# EAGLE schematic Snach Basics 01 (EAGLE 7.3.0)
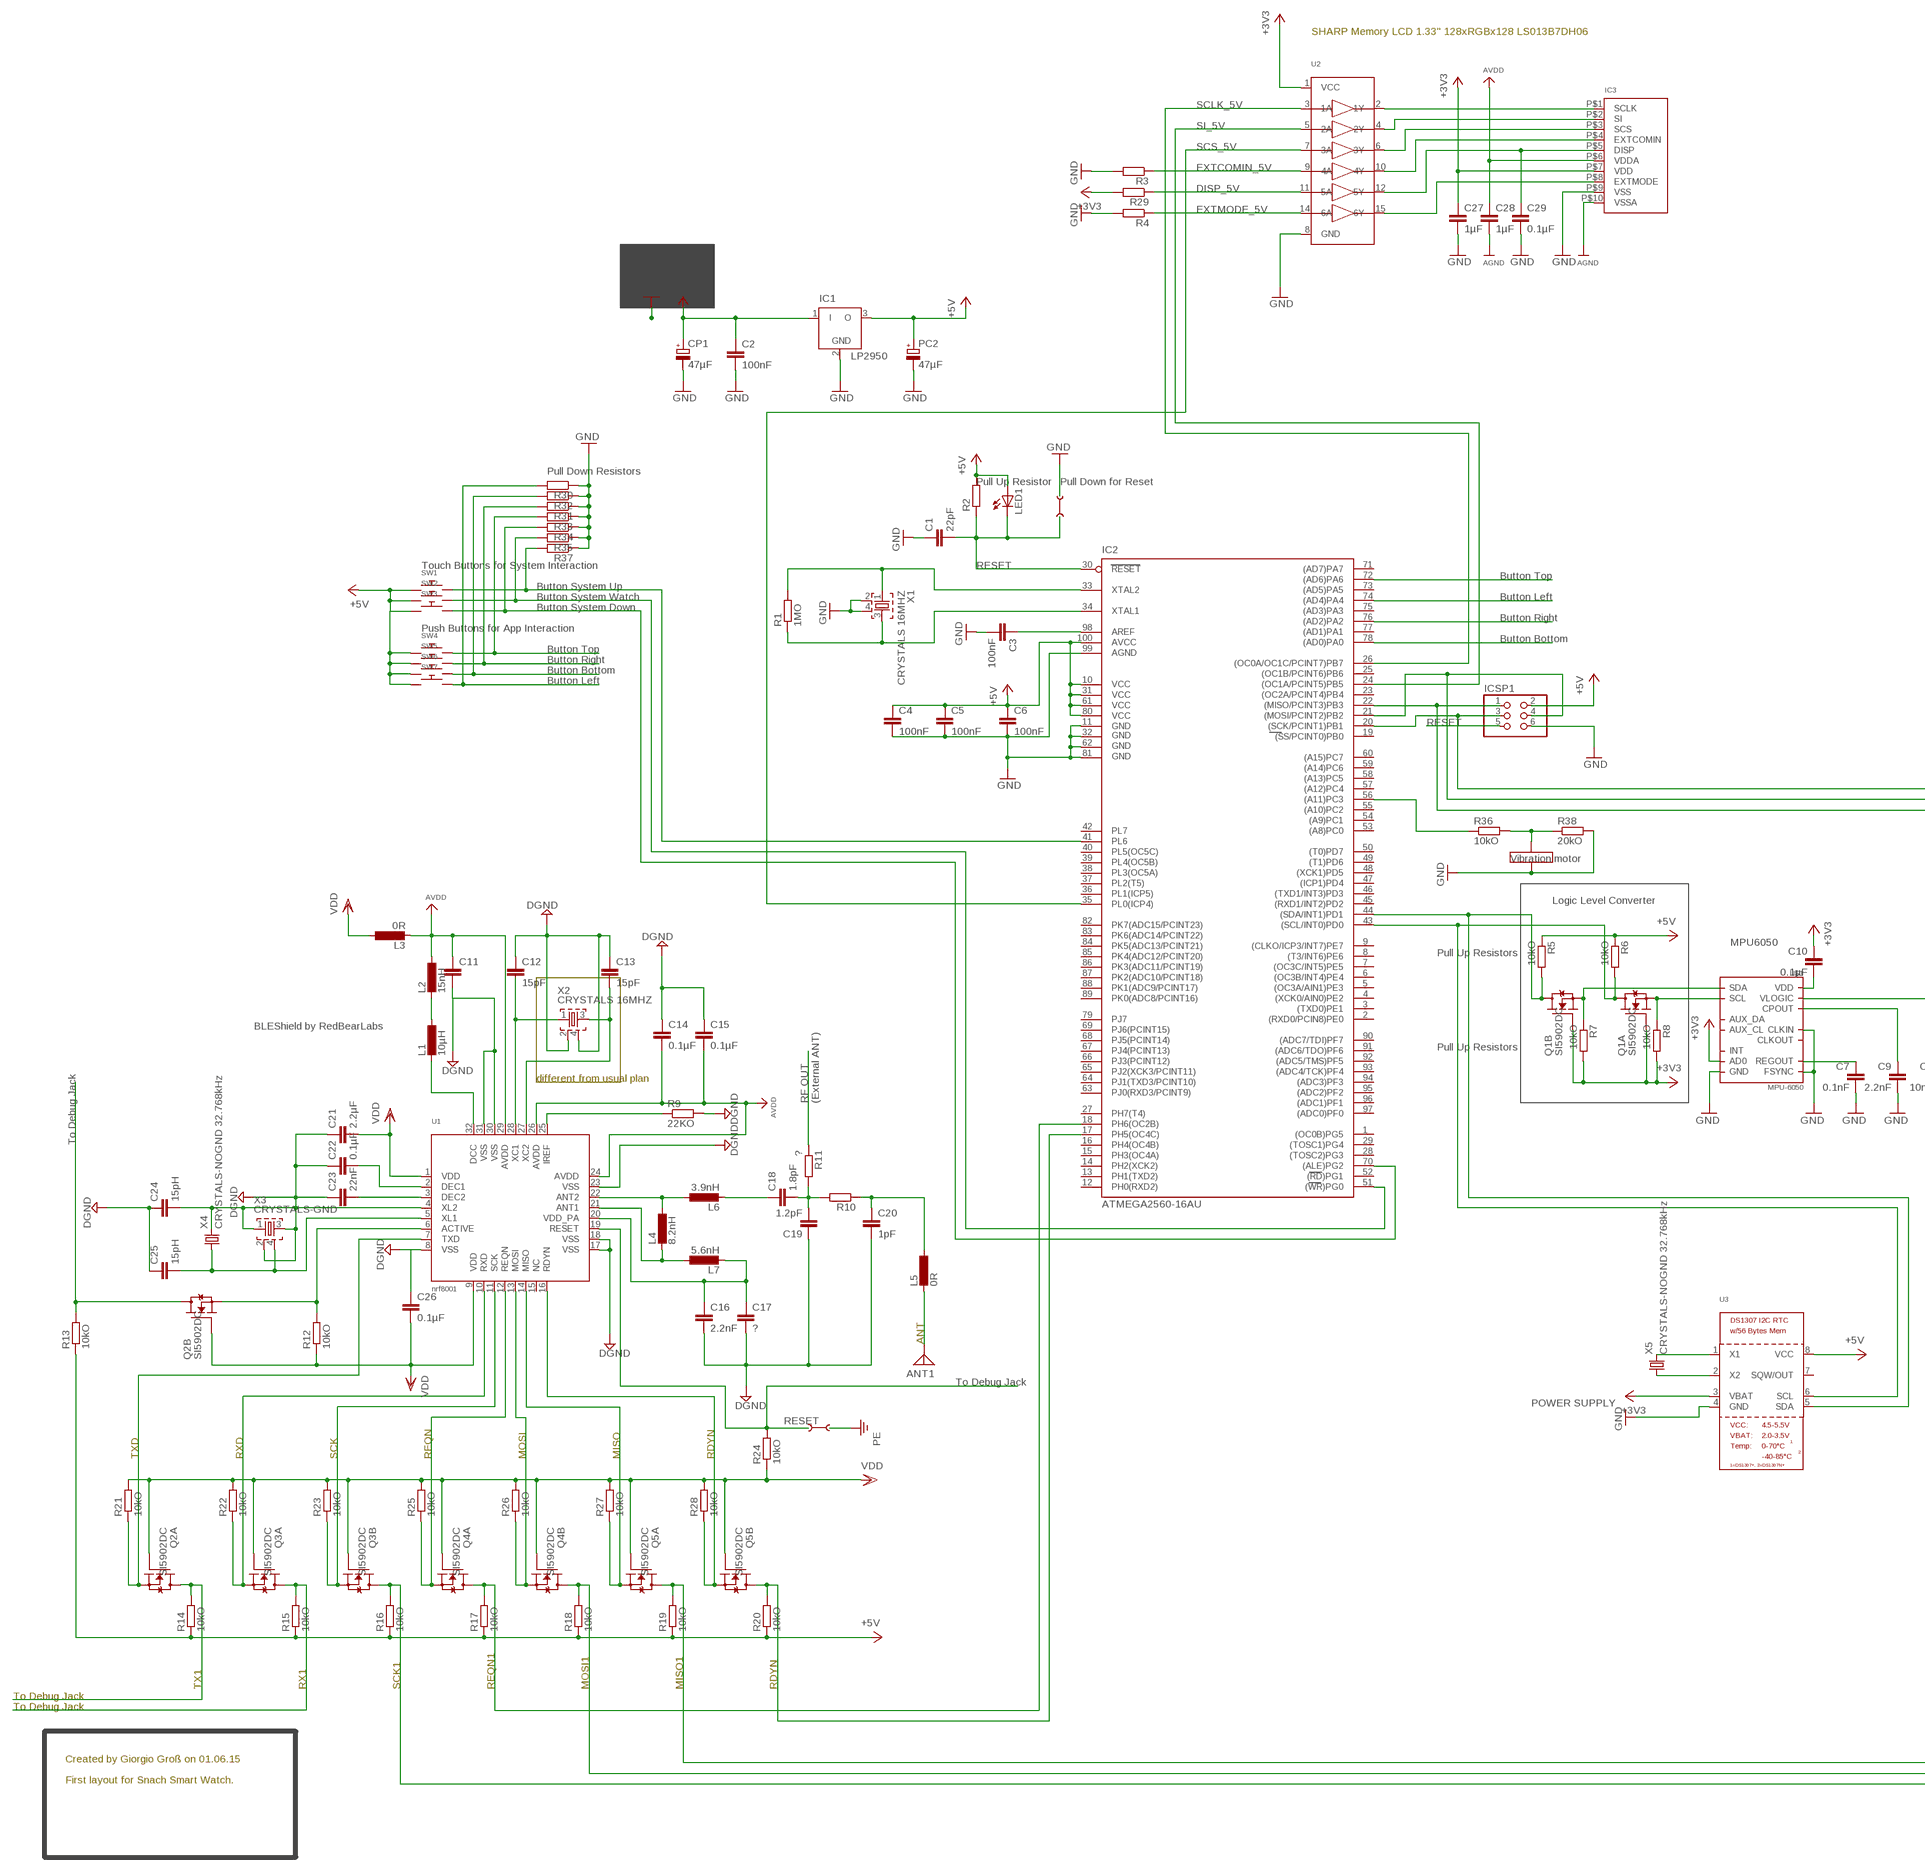
[diagram p0: schematic, sheet 1, part 1 of 2]
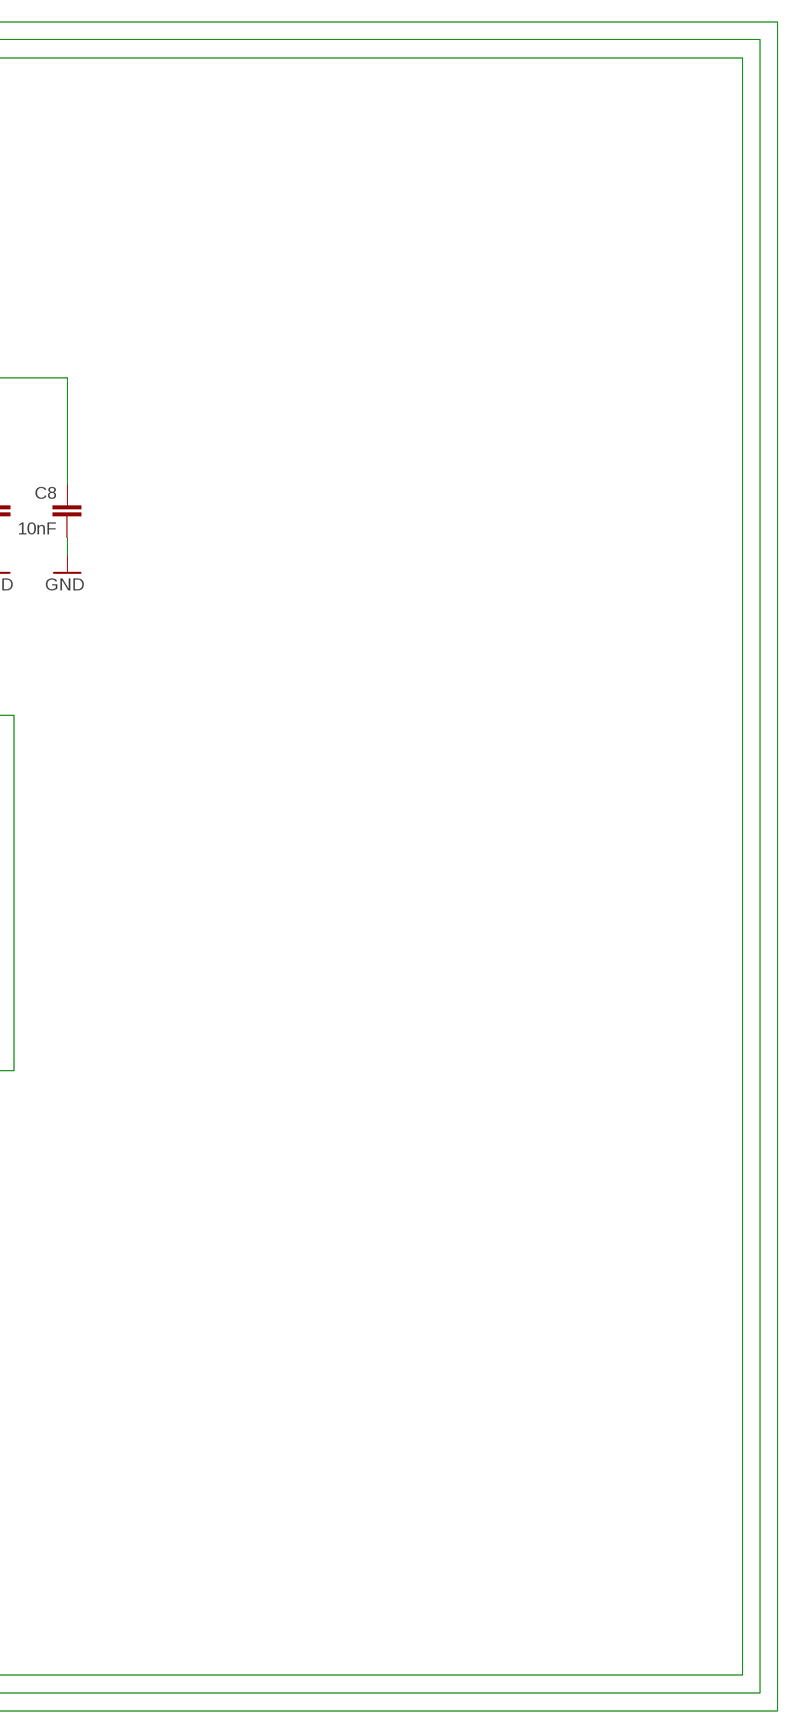
[diagram p1: schematic, sheet 1, part 2 of 2]

## Parts
ANT1  ANTENNA  [PAD-01]
C1  22pF  C-EUC1812  [C1812]
C2  100nF  C-EUC0402  [C0402]
C3  100nF  C-EUC1206K  [C1206K]
C4  100nF  C-EUC1812K  [C1812K]
C5  100nF  C-EUC1812K  [C1812K]
C6  100nF  C-EUC1812K  [C1812K]
C7  0.1nF  C-EUC0402  [C0402]
C8  10nF  C-EUC0402  [C0402]
C9  2.2nF  C-EUC0402  [C0402]
C10  0.1µF  C-EUC0402  [C0402]
C11  C-EUC0504  [C0504]
C12  15pF  C-EUC0603  [C0603]
C13  15pF  C-EUC0603  [C0603]
C14  0.1µF  C-EUC0402K  [C0402K]
C15  0.1µF  C-EUC0402K  [C0402K]
C16  2.2nF  C-EUC0402  [C0402]
C17  ?  C-EUC0402  [C0402]
C18  1.8pF  C-EUC0402  [C0402]
C19  1.2pF  C-EUC0402  [C0402]
C20  1pF  C-EUC0402  [C0402]
C21  2.2µF  C-EUC0402  [C0402]
C22  0.1µF  C-EUC0402  [C0402]
C23  22nF  C-EUC0402  [C0402]
C24  15pH  C-EUC0504  [C0504]
C25  15pH  C-EUC0504  [C0504]
C26  0.1µF  C-EUC0402  [C0402]
C27  1µF  C-EUC0504  [C0504]
C28  1µF  C-EUC0504  [C0504]
C29  0.1µF  C-EUC0504  [C0504]
CP1  47µF  CPOL-EU085CS-1R  [085CS_1R]
IC1  LP2950  [DPACK]
IC2  ATMEGA2560-16AU  [TQFP100]
IC3  DISP_EINK_SHARPMEMORYLCD_10PIN  [FPC_10PIN_52892-1095]
ICSP1  PINHD-2X3  [2X03]
J1  JUMP-Q  [JUMP]
J2  JUMP-Q  [JUMP]
L1  10µH  L-EUL1812  [L1812]
L2  15nH  L-EUL1812  [L1812]
L3  0R  L-EUL1812  [L1812]
L4  8.2nH  L-EUL3216C  [L3216C]
L5  0R  L-EUL2012C  [L2012C]
L6  3.9nH  L-EUL3216C  [L3216C]
L7  5.6nH  L-EUL3216C  [L3216C]
LED1  LEDSMART-LED  [SMART-LED]
PC2  47µF  CPOL-EU085CS-1R  [085CS_1R]
Q1  SI5902DC  [1206-8CHIP-FET]
Q2  SI5902DC  [1206-8CHIP-FET]
Q3  SI5902DC  [1206-8CHIP-FET]
Q4  SI5902DC  [1206-8CHIP-FET]
Q5  SI5902DC  [1206-8CHIP-FET]
R1  1MO  R-EU_R0805  [R0805]
R2  R-EU_M0805  [M0805]
R3  R-EU_R0603  [R0603]
R4  R-EU_R0603  [R0603]
R5  10kO  R-EU_R0201  [R0201]
R6  10kO  R-EU_R0201  [R0201]
R7  10kO  R-EU_R0201  [R0201]
R8  10kO  R-EU_R0201  [R0201]
R9  22KO  R-EU_R0402  [R0402]
R10  R-EU_M0805  [M0805]
R11  ?  R-EU_M0805  [M0805]
R12  10kO  R-EU_R0603  [R0603]
R13  10kO  R-EU_R0603  [R0603]
R14  10kO  R-EU_R0603  [R0603]
R15  10kO  R-EU_R0603  [R0603]
R16  10kO  R-EU_R0603  [R0603]
R17  10kO  R-EU_R0603  [R0603]
R18  10kO  R-EU_R0603  [R0603]
R19  10kO  R-EU_R0603  [R0603]
R20  10kO  R-EU_R0603  [R0603]
R21  10kO  R-EU_R0805  [R0805]
R22  10kO  R-EU_R0805  [R0805]
R23  10kO  R-EU_R0805  [R0805]
R24  10kO  R-EU_R0603  [R0603]
R25  10kO  R-EU_R0805  [R0805]
R26  10kO  R-EU_R0805  [R0805]
R27  10kO  R-EU_R0805  [R0805]
R28  10kO  R-EU_R0805  [R0805]
R29  R-EU_R0603  [R0603]
R30  R-EU_R0603  [R0603]
R31  R-EU_R0603  [R0603]
R32  R-EU_R0603  [R0603]
R33  R-EU_R0603  [R0603]
R34  R-EU_R0603  [R0603]
R35  R-EU_R0603  [R0603]
R36  10kO  R-EU_R0402  [R0402]
R37  R-EU_R0603  [R0603]
R38  20kO  R-EU_R0402  [R0402]
SW1  SWITCH_PUSHBUTTONSOFTTOUCHSMD_SJ  [PUSHBUTTON_SMD_SJ]
SW2  SWITCH_PUSHBUTTONSOFTTOUCHSMD_SJ  [PUSHBUTTON_SMD_SJ]
SW3  SWITCH_PUSHBUTTONSOFTTOUCHSMD_SJ  [PUSHBUTTON_SMD_SJ]
SW4  SWITCH_PUSHBUTTONSOFTTOUCHSMD_SJ  [PUSHBUTTON_SMD_SJ]
SW5  SWITCH_PUSHBUTTONSOFTTOUCHSMD_SJ  [PUSHBUTTON_SMD_SJ]
SW6  SWITCH_PUSHBUTTONSOFTTOUCHSMD_SJ  [PUSHBUTTON_SMD_SJ]
SW7  SWITCH_PUSHBUTTONSOFTTOUCHSMD_SJ  [PUSHBUTTON_SMD_SJ]
U1  nrf8001  NRF8001  [QFN32_5MM]
U2  74HC4050D  [SOIC16]
U3  RTC_DS1307  [SOIC8_150MIL]
U$1  MPU-6050  [QFN.24.4X4]
X1  CRYSTALS 16MHZ  CRYSTALS-GND-LID-IQXC-42  [2.0X1.6-4-PAD]
X2  CRYSTALS 16MHZ  CRYSTALS-GND-LID-CFPX-104  [5.2X3.4-4-PAD]
X3  CRYSTALS-GND  CRYSTALS-GND-LID-IQXC-42  [2.0X1.6-4-PAD]
X4  CRYSTALS-NOGND 32.768kHz  CRYSTALS-NOGND-12SMX-A  [7.5X5-2-PAD]
X5  CRYSTALS-NOGND 32.768kHz  CRYSTALS-NOGND-12SMX-B  [7.5X5-4-PAD]

## Nets
+3V3: C10.1 C27.1 IC3.P$7(VDD) Q1.2(A:G) Q1.4(B:G) R7.2 R8.2 R29.2 U2.1(VCC) U3.3(VBAT) U$1.9(AD0)
+5V: C4.1 C5.1 C6.1 IC1.3(O) IC2.10(VCC) IC2.31(VCC1) IC2.61(VCC2) IC2.80(VCC3) IC2.100(AVCC) ICSP1.2 LED1.A PC2.+ R2.2 R5.1 R6.1 R13.1 R14.1 R15.1 R16.1 R17.1 R18.1 R19.1 R20.1 SW1.P$1 SW2.P$1 SW3.P$1 SW4.P$1 SW5.P$1 SW6.P$1 SW7.P$1 U3.8(VCC)
AGND: C28.2 IC3.P$10(VSSA)
AVDD: C11.1 C14.2 C15.2 C28.1 IC3.P$6(VDDA) L2.1 L3.2 U1.24(AVDD) U1.26(AVDD) U1.29(AVDD)
DGND: C11.2 C12.1 C13.1 C14.1 C15.1 C16.2 C17.2 C19.1 C20.2 C21.1 C22.1 C23.1 C24.1 C24.2 C25.1 C26.1 R9.2 U1.4(XL2) U1.8(VSS) U1.17(VSS) U1.18(VSS) U1.23(VSS) U1.30(VSS) U1.31(VSS) X2.2 X2.4 X3.1 X3.2 X3.3 X4.2
GND: C1.1 C2.2 C3.2 C4.2 C5.2 C6.2 C7.2 C8.2 C9.2 C27.2 C29.2 CP1.- IC1.2(GND) IC2.11(GND) IC2.32(GND1) IC2.62(GND2) IC2.81(GND3) IC2.99(AGND) ICSP1.6 PC2.- R3.2 R4.2 R30.1 R31.1 R32.1 R33.1 R34.1 R35.1 R37.1 R38.2 U2.8(GND) U3.4(GND) U$1.1(CLKIN) U$1.11(FSYNC) U$1.18(GND) X1.2 X1.4
N$1: IC2.33(XTAL2) R1.2 X1.1
N$2: IC2.34(XTAL1) R1.1 X1.3
N$3: C3.1 IC2.98(AREF)
N$4: IC2.22((MISO/PCINT3)PB3) ICSP1.1 Q5.7(A:D) Q5.8(A:D) R19.2
N$5: R3.1 U2.9(4A)
N$6: L1.2 U1.32(DCC)
N$7: R29.1 U2.11(5A)
N$8: L1.1 L2.2
N$9: ICSP1.5
N$10: IC2.44((SDA/INT1)PD1) Q1.5(B:D) Q1.6(B:D) R5.2 U3.5(SDA)
N$11: IC2.43((SCL/INT0)PD0) Q1.7(A:D) Q1.8(A:D) R6.2 U3.6(SCL)
N$12: C8.1 U$1.8(VLOGIC)
N$13: C7.1 U$1.10(REGOUT)
N$14: C10.2 U$1.13(VDD)
N$15: C13.2 U1.27(XC2) X2.3
N$16: C18.1 L6.2
N$17: R9.1 U1.25(IREF)
N$18: C9.1 U$1.20(CPOUT)
N$19: Q1.1(A:S) R8.1 U$1.23(SCL)
N$20: Q1.3(B:S) R7.1 U$1.24(SDA)
N$21: C12.2 U1.28(XC1) X2.1
N$22: Q2.3(B:S) R12.2 U1.6(ACTIVE)
N$23: R11.1
N$24: L4.1 L6.1 U1.22(ANT2)
N$25: L4.2 L7.1 U1.21(ANT1)
N$26: R24.2 U1.19(RESET)
N$27: C16.1 C17.1 L7.2 U1.20(VDD_PA)
N$29: C18.2 C19.2 R10.2 R11.2
N$30: C22.2 U1.2(DEC1)
N$31: C20.1 L5.1 R10.1
N$32: ANT1.1 L5.2
N$33: C23.2 U1.3(DEC2)
N$34: C25.2 U1.5(XL1) X3.4 X4.1
N$35: Q2.5(B:D) Q2.6(B:D) R13.2
N$36: Q2.7(A:D) Q2.8(A:D) R14.2
N$37: Q2.1(A:S) R21.1 U1.7(TXD)
N$38: Q3.7(A:D) Q3.8(A:D) R15.2
N$39: IC2.20((SCK/PCINT1)PB1) ICSP1.3 Q3.5(B:D) Q3.6(B:D) R16.2
N$40: IC2.18(PH6(OC2B)) Q4.7(A:D) Q4.8(A:D) R17.2
N$41: IC2.56((A11)PC3) R36.1
N$42: IC3.P$1(SCLK) U2.2(1Y)
N$43: IC2.17(PH5(OC4C)) Q5.5(B:D) Q5.6(B:D) R20.2
N$44: IC3.P$2(SI) U2.4(2Y)
N$45: IC3.P$3(SCS) U2.6(3Y)
N$46: Q3.1(A:S) R22.1 U1.10(RXD)
N$47: Q3.3(B:S) R23.1 U1.11(SCK)
N$48: Q4.1(A:S) R25.1 U1.12(REQN)
N$49: Q4.3(B:S) R26.1 U1.13(MOSI)
N$50: Q5.1(A:S) R27.1 U1.14(MISO)
N$51: Q5.3(B:S) R28.1 U1.16(RDYN)
N$52: IC3.P$4(EXTCOMIN) U2.10(4Y)
N$53: C29.1 IC3.P$5(DISP) U2.12(5Y)
N$54: IC3.P$8(EXTMODE) U2.15(6Y)
N$55: R4.1 U2.14(6A)
N$56: IC2.76((AD2)PA2)
N$57: IC3.P$9(VSS) ; supply symbol labelled GND
N$58: IC2.26((OC0A/OC1C/PCINT7)PB7) U2.3(1A)
N$59: IC2.24((OC1A/PCINT5)PB5) U2.5(2A)
N$60: IC2.35(PL0(ICP4)) U2.7(3A)
N$61: IC2.21((MOSI/PCINT2)PB2) ICSP1.4 Q4.5(B:D) Q4.6(B:D) R18.2
N$62: R36.2 R38.1
N$63: IC2.41(PL6) R37.2 SW1.P$2
N$64: IC2.51((WR)PG0) R35.2 SW2.P$2
N$65: IC2.70((ALE)PG2) R34.2 SW3.P$2
N$66: U3.1(X1) X5.4
N$67: U3.2(X2) X5.1
N$B_BOTTOM: IC2.78((AD0)PA0) R32.2 SW6.P$2
N$B_LEFT: IC2.74((AD4)PA4) R30.2 SW7.P$2
N$B_RIGHT: R31.2 SW5.P$2
N$B_TOP: IC2.72((AD6)PA6) R33.2 SW4.P$2
RESET: C1.2 IC2.30(RESET) LED1.B(C) R2.1
V+: C2.1 CP1.+ IC1.1(I)
VDD: C21.2 C26.2 L3.1 Q2.2(A:G) Q2.4(B:G) Q3.2(A:G) Q3.4(B:G) Q4.2(A:G) Q4.4(B:G) Q5.2(A:G) Q5.4(B:G) R12.1 R21.2 R22.2 R23.2 R24.1 R25.2 R26.2 R27.2 R28.2 U1.1(VDD) U1.9(VDD)
Unconnected: IC2.1((OC0B)PG5) IC2.2((RXD0/PCIN8)PE0) IC2.3((TXD0)PE1) IC2.4((XCK0/AIN0)PE2) IC2.5((OC3A/AIN1)PE3) IC2.6((OC3B/INT4)PE4) IC2.7((OC3C/INT5)PE5) IC2.8((T3/INT6)PE6) IC2.9((CLKO/ICP3/INT7)PE7) IC2.12(PH0(RXD2)) IC2.13(PH1(TXD2)) IC2.14(PH2(XCK2)) IC2.15(PH3(OC4A)) IC2.16(PH4(OC4B)) IC2.19((SS/PCINT0)PB0) IC2.23((OC2A/PCINT4)PB4) IC2.25((OC1B/PCINT6)PB6) IC2.27(PH7(T4)) IC2.28((TOSC2)PG3) IC2.29((TOSC1)PG4) IC2.36(PL1(ICP5)) IC2.37(PL2(T5)) IC2.38(PL3(OC5A)) IC2.39(PL4(OC5B)) IC2.40(PL5(OC5C)) IC2.42(PL7) IC2.45((RXD1/INT2)PD2) IC2.46((TXD1/INT3)PD3) IC2.47((ICP1)PD4) IC2.48((XCK1)PD5) IC2.49((T1)PD6) IC2.50((T0)PD7) IC2.52((RD)PG1) IC2.53((A8)PC0) IC2.54((A9)PC1) IC2.55((A10)PC2) IC2.57((A12)PC4) IC2.58((A13)PC5) IC2.59((A14)PC6) IC2.60((A15)PC7) IC2.63(PJ0(RXD3/PCINT9)) IC2.64(PJ1(TXD3/PCINT10)) IC2.65(PJ2(XCK3/PCINT11)) IC2.66(PJ3(PCINT12)) IC2.67(PJ4(PCINT13)) IC2.68(PJ5(PCINT14)) IC2.69(PJ6(PCINT15)) IC2.71((AD7)PA7) IC2.73((AD5)PA5) IC2.75((AD3)PA3) IC2.77((AD1)PA1) IC2.79(PJ7) IC2.82(PK7(ADC15/PCINT23)) IC2.83(PK6(ADC14/PCINT22)) IC2.84(PK5(ADC13/PCINT21)) IC2.85(PK4(ADC12/PCINT20)) IC2.86(PK3(ADC11/PCINT19)) IC2.87(PK2(ADC10/PCINT18)) IC2.88(PK1(ADC9/PCINT17)) IC2.89(PK0(ADC8/PCINT16)) IC2.90((ADC7/TDI)PF7) IC2.91((ADC6/TDO)PF6) IC2.92((ADC5/TMS)PF5) IC2.93((ADC4/TCK)PF4) IC2.94((ADC3)PF3) IC2.95((ADC2)PF2) IC2.96((ADC1)PF1) IC2.97((ADC0)PF0) U1.15(NC) U3.7(SQW/OUT) U$1.6(AUX_DA) U$1.7(AUX_CL) U$1.12(INT) U$1.22(CLKOUT)

## Notes on the sheet
- SHARP Memory LCD 1.33" 128xRGBx128 LS013B7DH06
- SCLK_5V
- SI_5V
- SCS_5V
- EXTCOMIN_5V
- DISP_5V
- EXTMODE_5V
- Powersupply
- Pull Down Resistors
- Pull Up Resistor | Pull Down for Reset
- Touch Buttons for System Interaction | RESET
- Button Top
- Button System Up
- Button System Watch | Button Left
- Button System Down
- Button Right
- Push Buttons for App Interaction
- Button Bottom
- Button Top
- Button Right
- Button Bottom
- Button Left
- RESET
- Vibration motor
- Logic Level Converter
- MPU6050
- Pull Up Resistors
- BLEShield by RedBearLabs
- Pull Up Resistors
- different from usual plan
- RF OUT
  (External ANT)
- To Debug Jack
- ANT
- To Debug Jack
- POWER SUPPLY
- RESET
- TXD | RXD | SCK | REQN | MOSI | MISO | RDYN
- TX1 | RX1 | SCK1 | REQN1 | MOSI1 | MISO1 | RDYN
- To Debug Jack
- To Debug Jack
- Created by Giorgio Groß on 01.06.15
- First layout for Snach Smart Watch.

## Power pins joined to a net without a drawn wire
TP: U1.33(TP)

## Library data of the parts
ANT1 = discrete:ANTENNA: Antenna
C1-C29 = rcl:C-EU: CAPACITOR, European symbol
CP1 PC2 = rcl:CPOL-EU: POLARIZED CAPACITOR, European symbol
IC1 = linear:LP2950: 100 mA, Low Power Low Dropout Voltage Regulator Source: http://www.onsemi.com/pub/Collateral/LP2950-D.PDF
IC2 = atmel-2005:ATMEGA*: MICROCONTROLLER 64/128/256 Kbytes FLASH 4 Kbytes EEPROM 8 Kbytes SRAM 86 General Purpose I/O pins 12-channels16-bit PWM 4 x Serial USARTs 16-channels 10-bit A/D
IC3 = microbuilder:DISP_EINK_SHARPMEMORYLCD_10PIN: Sharp Mono Memory LCD LS013B4DN02 - 1.35" 96x96 Pixels LS027B7DH01 - 2.7" 400x240 Pixels
ICSP1 = pinhead:PINHD-2X3: PIN HEADER
J1 J2 = jumper:JUMP-Q: JUMPER header
L1-L7 = rcl:L-EU: INDUCTOR, European symbol
LED1 = led:LED: LED OSRAM: - CHIPLED LG R971, LG N971, LY N971, LG Q971, LY Q971, LO R971, LY R971 LH N974, LH R974 LS Q976, LO Q976, LY Q976 LO Q996 - Hyper CHIPLED LW Q18S LB Q993, LB Q99A, LB R99A - SideLED LS A670, LO A670, LY A670, LG A670, LP A670 LB A673, LV A673, LT A673, LW A673 LH A674 LY A675 LS A676, LA A676, LO A676, LY A676, LW A676 LS A679, LY A679, LG A679 - Hyper Micro SIDELED® LS Y876, LA Y876, LO Y876, LY Y876 LT Y87S - SmartLED LW L88C, LW L88S LB L89C, LB L89S, LG L890 LS L89K, LO L89K, LY L89K LS L896, LA L896, LO L896, LY L896 - TOPLED LS T670, LO T670, LY T670, LG T670, LP T670 LSG T670, LSP T670, LSY T670, LOP T670, LYG T670 LG T671, LOG T671, LSG T671 LB T673, LV T673, LT T673, LW T673 LH T674 LS T676, LA T676, LO T676, LY T676, LB T676, LH T676, LSB T676, LW T676 LB T67C, LV T67C, LT T67C, LS T67K, LO T67K, LY T67K, LW E67C LS E67B, LA E67B, LO E67B, LY E67B, LB E67C, LV E67C, LT E67C LW T67C LS T679, LY T679, LG T679 LS T770, LO T770, LY T770, LG T770, LP T770 LB T773, LV T773, LT T773, LW T773 LH T774 LS E675, LA E675, LY E675, LS T675 LS T776, LA T776, LO T776, LY T776, LB T776 LHGB T686 LT T68C, LB T68C - Hyper Mini TOPLED® LB M676 - Mini TOPLED Santana® LG M470 LS M47K, LO M47K, LY M47K Source: http://www.osram.convergy.de LUXEON: - LUMILED® LXK2-PW12-R00, LXK2-PW12-S00, LXK2-PW14-U00, LXK2-PW14-V00 LXK2-PM12-R00, LXK2-PM12-S00, LXK2-PM14-U00 LXK2-PE12-Q00, LXK2-PE12-R00, LXK2-PE12-S00, LXK2-PE14-T00, LXK2-PE14-U00 LXK2-PB12-K00, LXK2-PB12-L00, LXK2-PB12-M00, LXK2-PB14-N00, LXK2-PB14-P00, LXK2-PB14-Q00 LXK2-PR12-L00, LXK2-PR12-M00, LXK2-PR14-Q00, LXK2-PR14-R00 LXK2-PD12-Q00, LXK2-PD12-R00, LXK2-PD12-S00 LXK2-PH12-R00, LXK2-PH12-S00 LXK2-PL12-P00, LXK2-PL12-Q00, LXK2-PL12-R00 Source: www.luxeon.com KINGBRIGHT: KA-3528ASYC Source: www.kingbright.com
Q1-Q5 = transistor-fet:SI5902DC: Dual N-Channel 30-V (D-S) MOSFET Source: http://www.vishay.com/docs/71053/71053.pdf
R1-R38 = rcl:R-EU_: RESISTOR, European symbol
SW1-SW7 = microbuilder:SWITCH_PUSHBUTTON: Buttons SOFTTOUCHSMD_SJ - Soft touch temporary push button (Super Junk Akihabara) Compatible with SKPMANE010 [Mouser: 688-SKPMAN]
U1 = microbuilder:NRF8001: nRF8001 - Bluetooth Low-Energy Transceiver VDD: 1.9-3.6V Temp: -40°C - 85°C
U2 = microbuilder:74HC4050D: 6-channel level shifter 74HC4050D - 2V-6V Supply Digikey: 74HC4050D,653-ND Mouser: 771-74HC4050D-T
U3 = microbuilder:RTC_DS1307: DS1307 I2C RTC with 56-Bytes RAM
U$1 = invensense:MPU-6050
X1-X3 = IQD-Frequency-Products:CRYSTALS-GND-LID: CRYSTALS WITH CAN GROUNDED
X4 X5 = IQD-Frequency-Products:CRYSTALS-NOGND: CRYSTALS CAN NOT GROUNDED